# Altium schematic sheet Top Level.SchDoc
size A
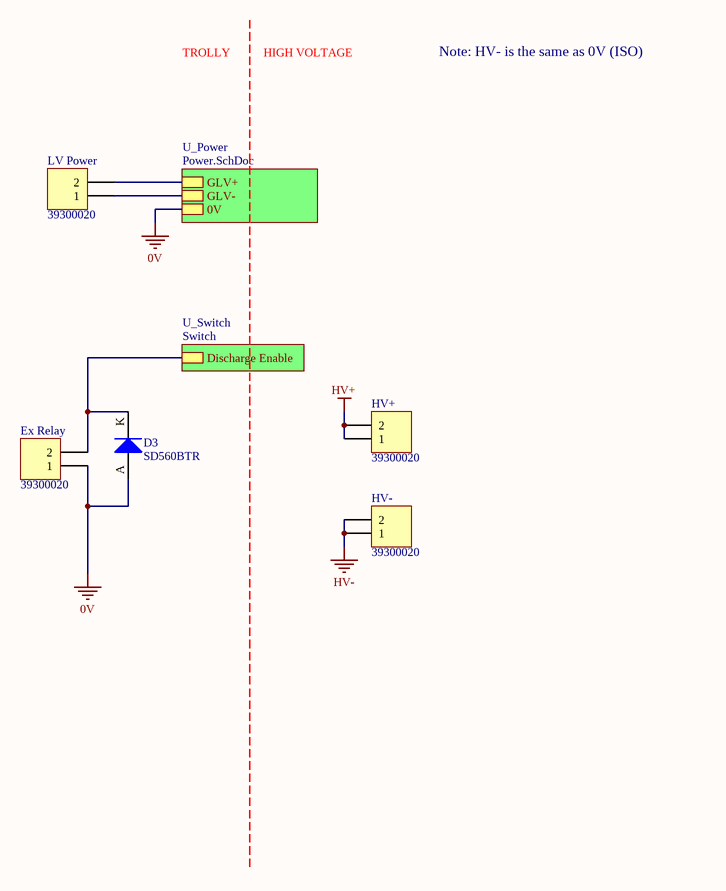
[diagram p0: Top Level.SchDoc]

## Parts
D3  SD560BTR  [SMB Diode]
Ex_Relay  39300020  [39300020]
HV+  39300020  [39300020]
HV-  39300020  [39300020]
LV_Power  39300020  [39300020]

## Sub-sheets
U_Power = Power.SchDoc: GLV+, GLV-, 0V
U_Switch = Switch: Discharge Enable

## Nets
0V: D3.A Ex_Relay.1 ; sheet U_Power/0V
HV+: HV+.1 HV+.2
HV-: HV-.1 HV-.2
NetD3_K: D3.K Ex_Relay.2 ; sheet U_Switch/Discharge Enable
NetLV_Power_1: LV_Power.1 ; sheet U_Power/GLV-
NetLV_Power_2: LV_Power.2 ; sheet U_Power/GLV+

## Notes on the sheet
- TROLLY
- HIGH VOLTAGE
- Note: HV- is the same as 0V (ISO)

## Library data of the parts
D3 = SD560BTR: 1.2V_F 600V 5A SMB; Manufacturer: SMC Diode Solutions; Part Number: SD560BTR; Digikey Part Number: 1655-1530-2-ND; Digikey Link: https://www.digikey.com/product-detail/en/smc-diode-solutions/SD560BTR/1655-1530-2-ND/6022620
Ex_Relay HV+ HV- LV_Power = 39300020: Pitch: 4.2mm; Row Spacing: 5.5mm; Angle: 90; Flange: No; Contact: Tin; Part Number: 39300020; Positions: 2; Digikey Part Number: WM21351-ND